# Altium schematic sheet AFE.SchDoc (part 1 of 3)
size 863 x 558 mm; Date: 28.05.2024; ApprovedBy: Arda B.; CheckedBy: Arda B.; DrawnBy: Arda Bozkurt; Revision: 001; SheetNumber: 3; SheetTotal: 5; Department: HDD; Size: A3; Time: 28.05.2024
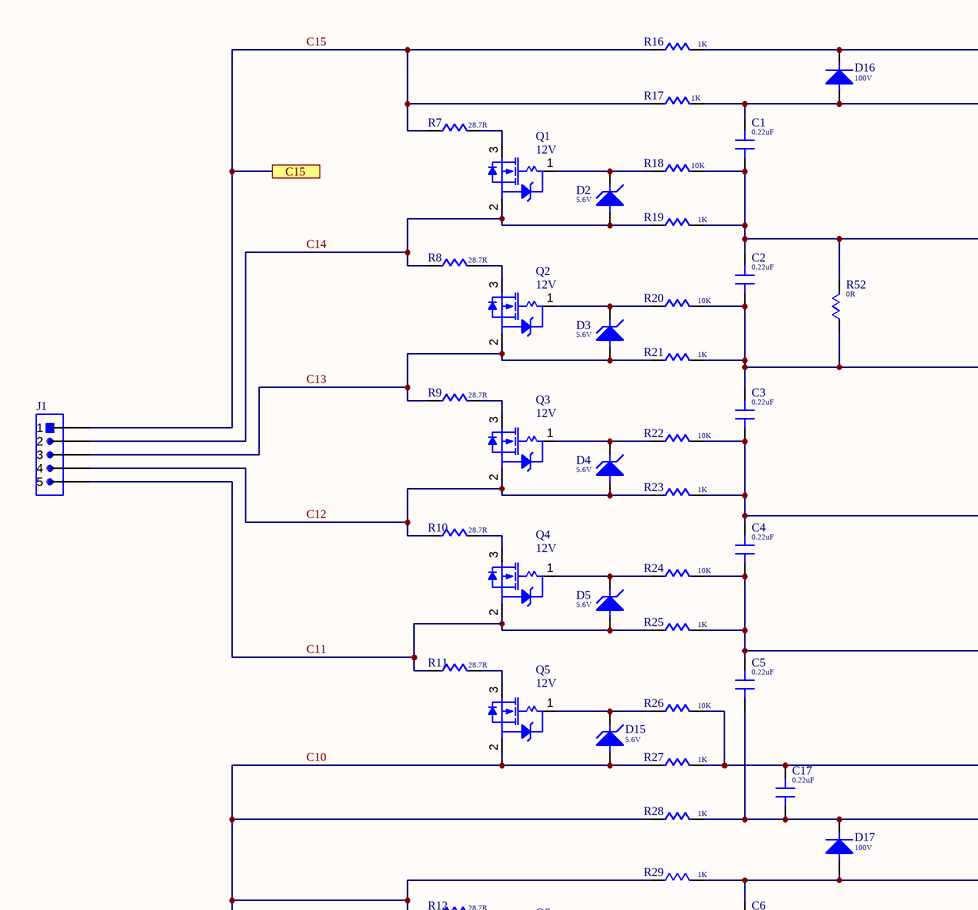
[diagram p0: AFE.SchDoc, top left]
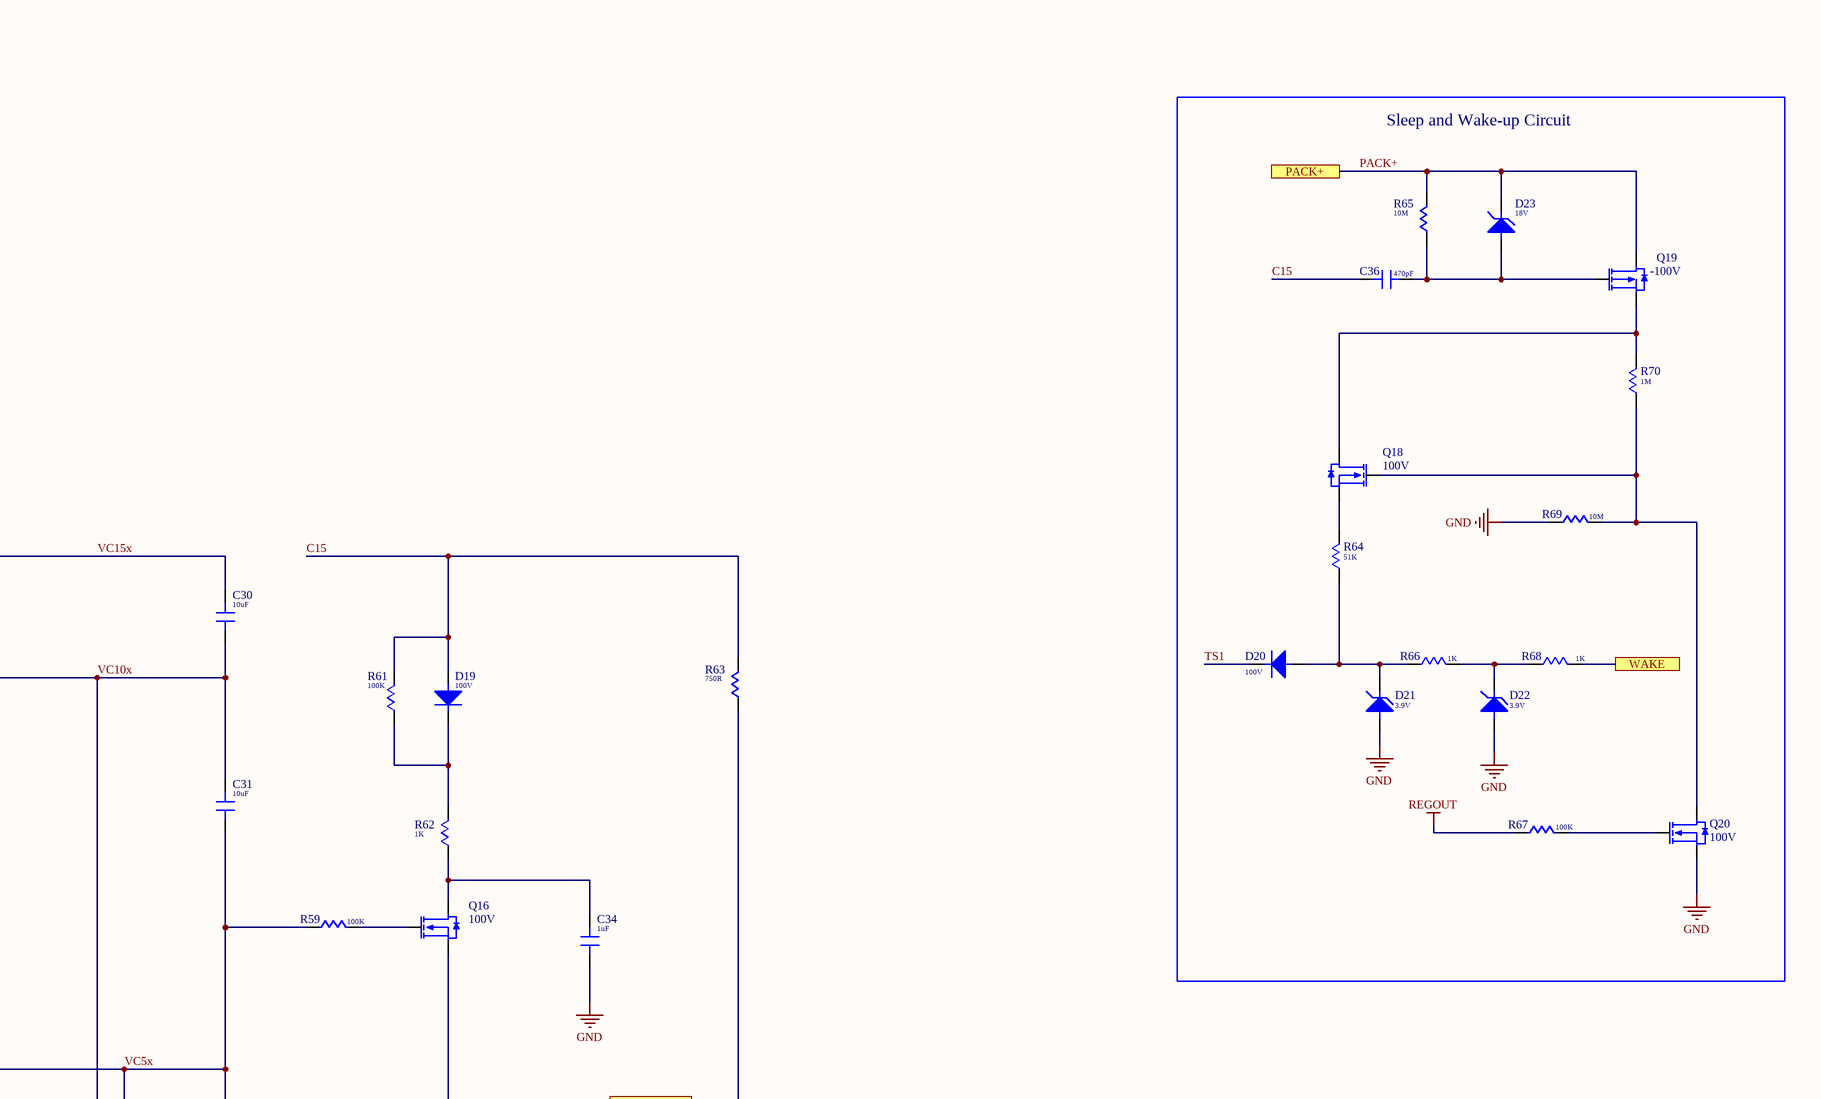
[diagram p1: AFE.SchDoc, top right]
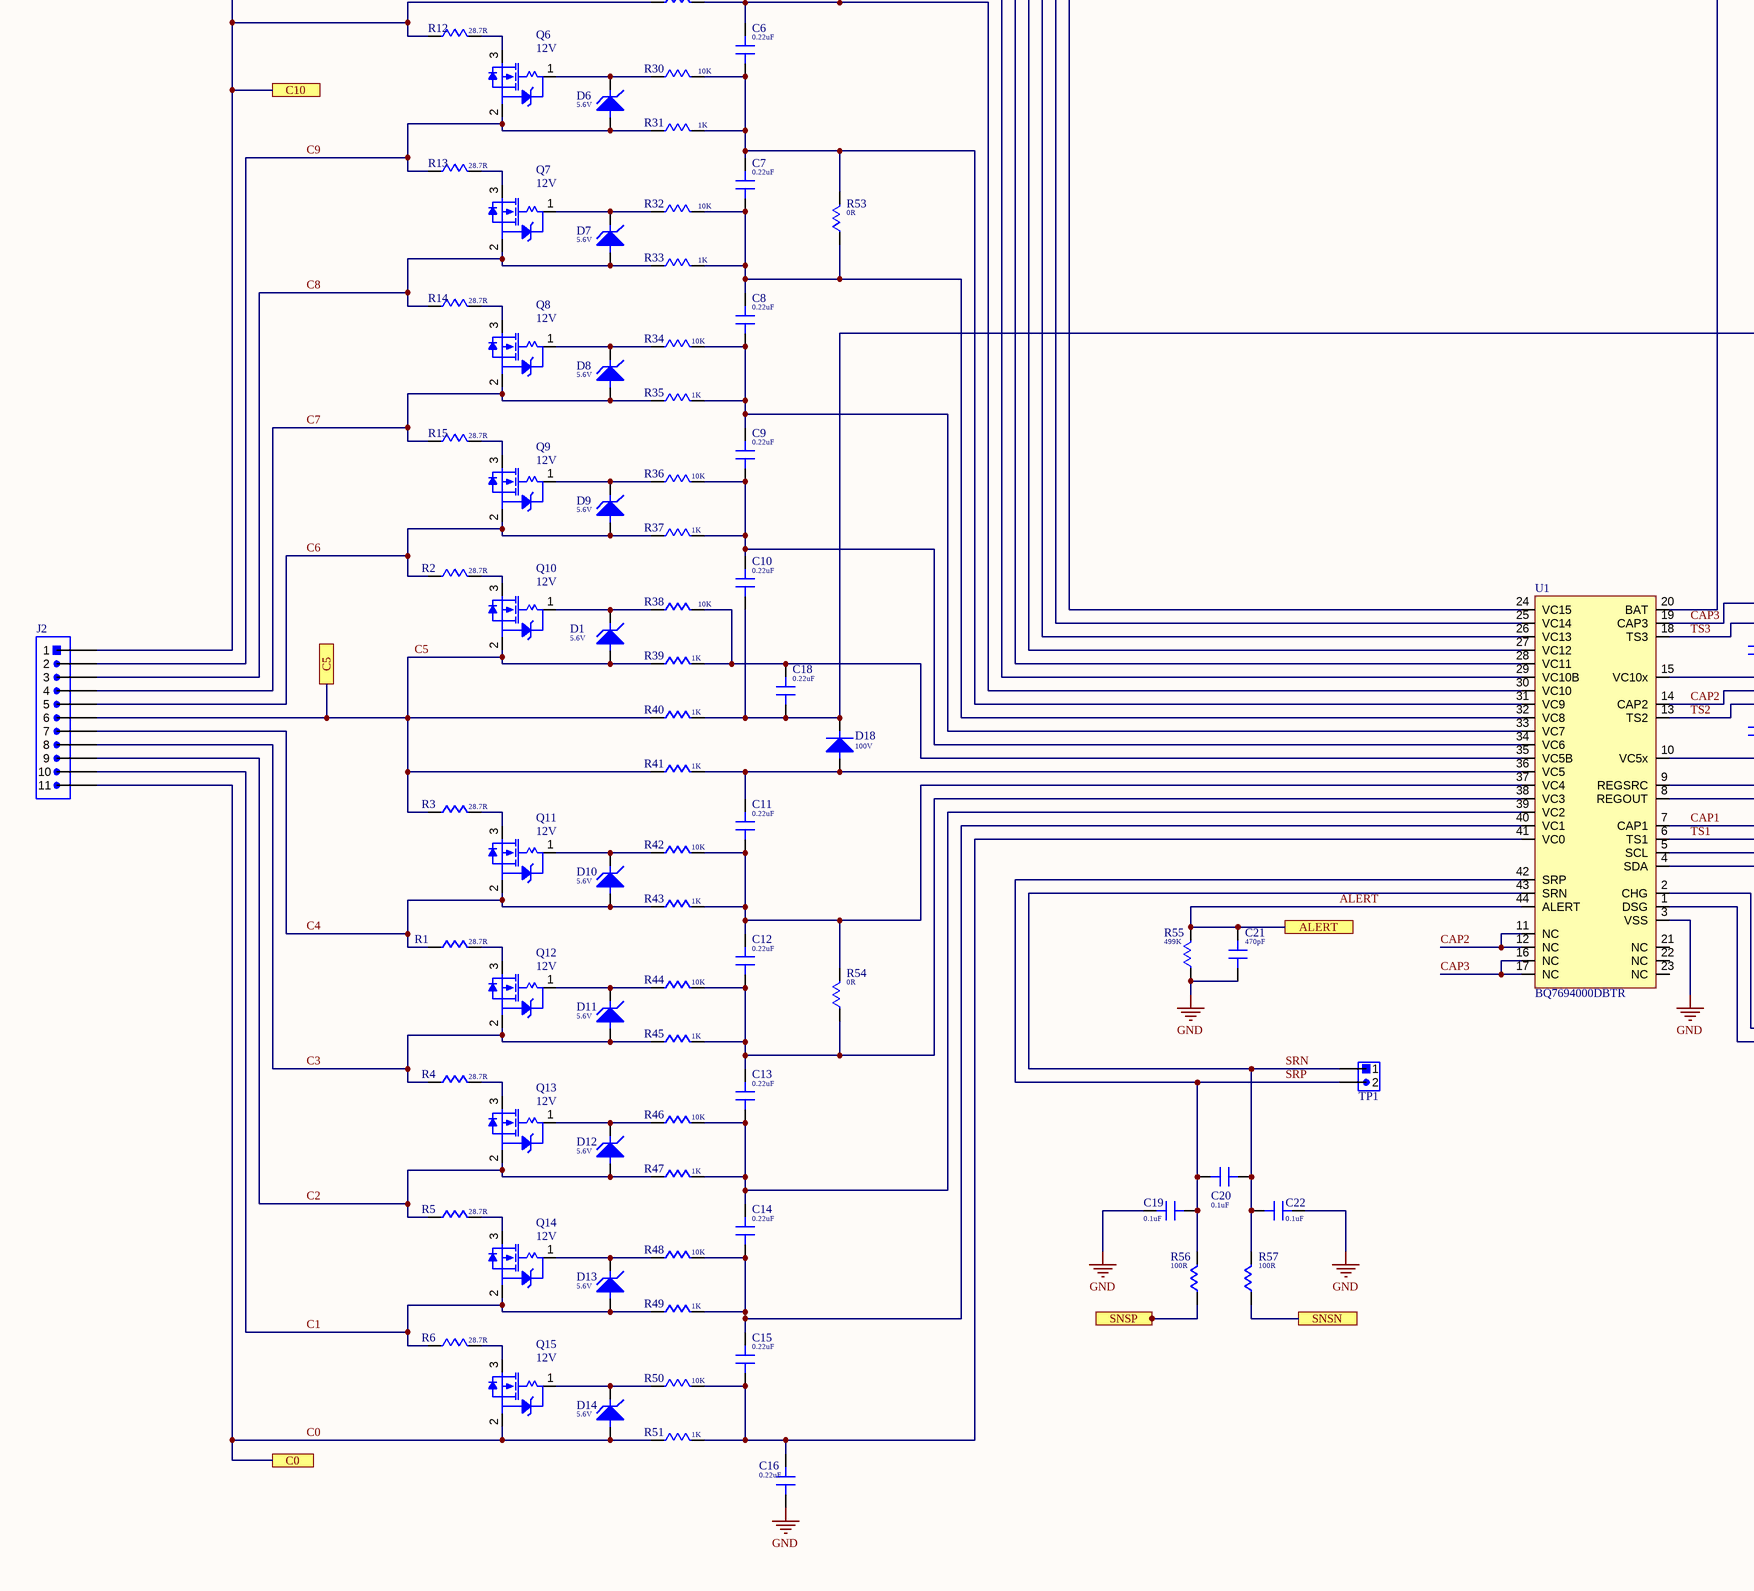
[diagram p2: AFE.SchDoc, bottom left]
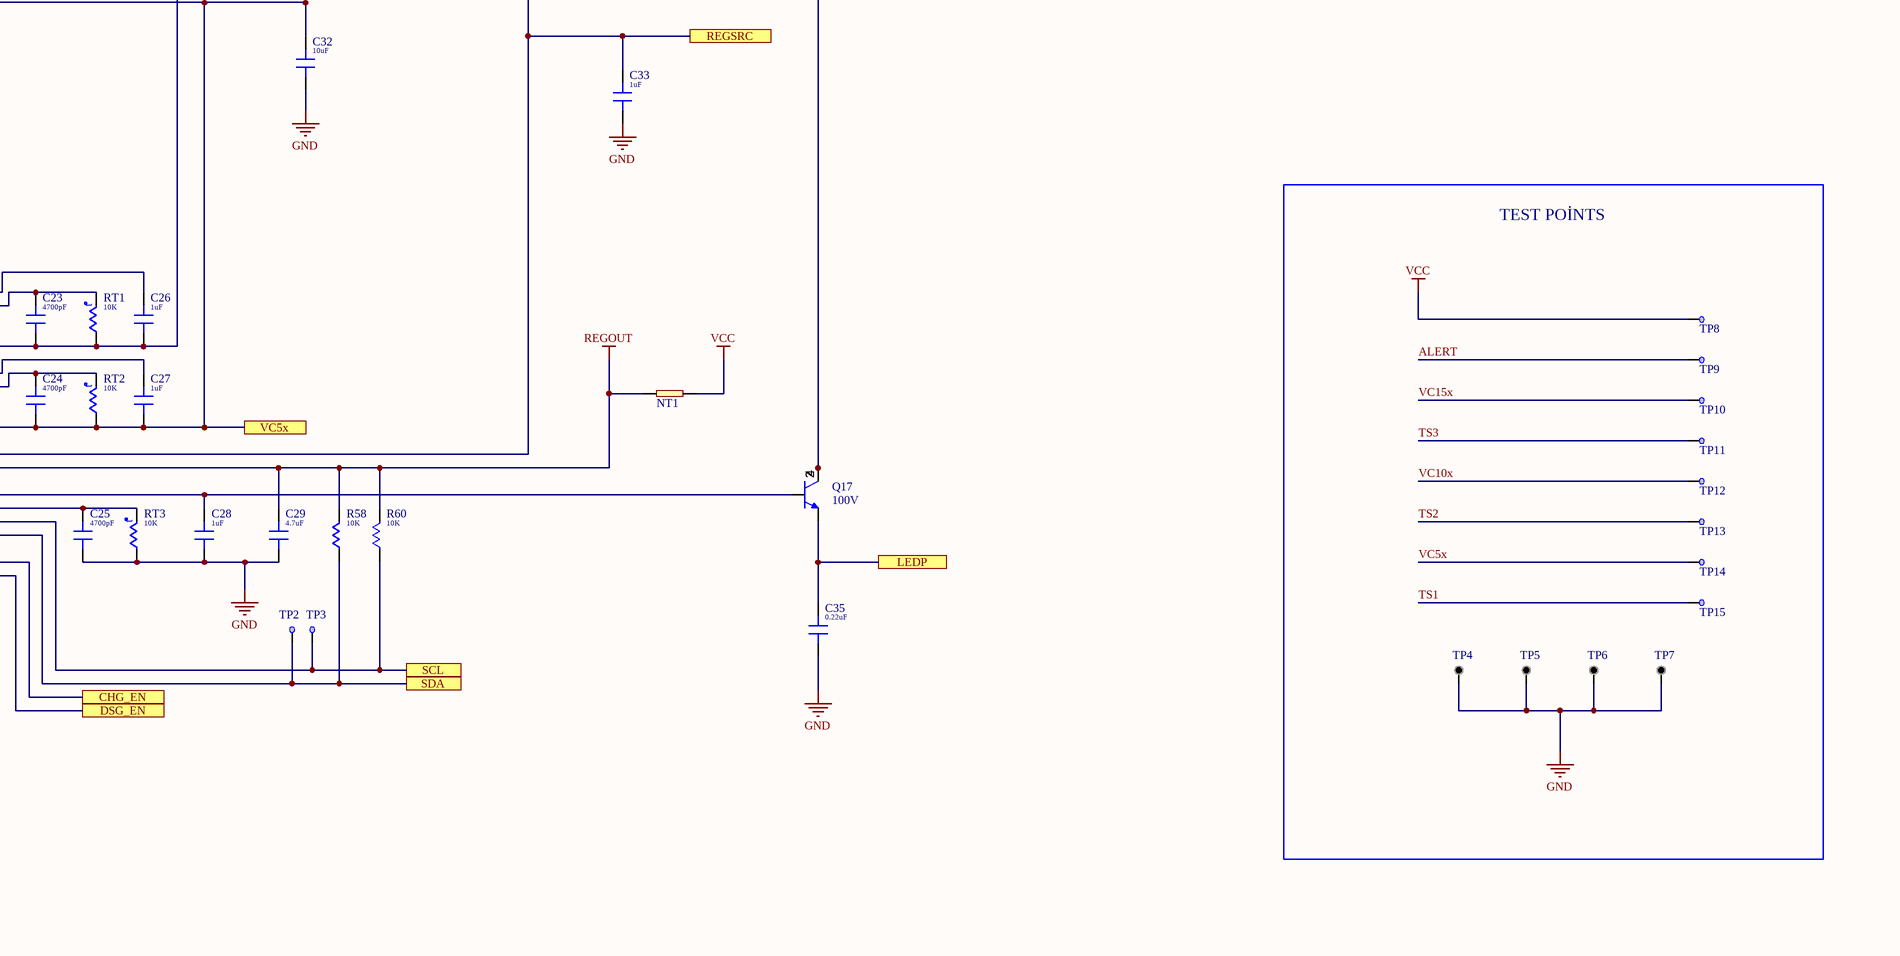
[diagram p3: AFE.SchDoc, bottom right]

## Parts
C1  value 0.22uF  [C_0603]  (hidden comment: 885012206048)
C2  value 0.22uF  [C_0603]  (hidden comment: 885012206048)
C3  value 0.22uF  [C_0603]  (hidden comment: 885012206048)
C4  value 0.22uF  [C_0603]  (hidden comment: 885012206048)
C5  value 0.22uF  [C_0603]  (hidden comment: 885012206048)
C6  value 0.22uF  [C_0603]  (hidden comment: 885012206048)
C7  value 0.22uF  [C_0603]  (hidden comment: 885012206048)
C8  value 0.22uF  [C_0603]  (hidden comment: 885012206048)
C9  value 0.22uF  [C_0603]  (hidden comment: 885012206048)
C10  value 0.22uF  [C_0603]  (hidden comment: 885012206048)
C11  value 0.22uF  [C_0603]  (hidden comment: 885012206048)
C12  value 0.22uF  [C_0603]  (hidden comment: 885012206048)
C13  value 0.22uF  [C_0603]  (hidden comment: 885012206048)
C14  value 0.22uF  [C_0603]  (hidden comment: 885012206048)
C15  value 0.22uF  [C_0603]  (hidden comment: 885012206048)
C16  value 0.22uF  [C_0603]  (hidden comment: 885012206048)
C17  value 0.22uF  [C_0603]  (hidden comment: 885012206048)
C18  value 0.22uF  [C_0603]  (hidden comment: 885012206048)
C19  value 0.1uF  [C_0603]  (hidden comment: C1608X7R1H104K080AA)
C20  value 0.1uF  [C_0603]  (hidden comment: C1608X7R1H104K080AA)
C21  value 470pF  [C_0603]  (hidden comment: 885012206081)
C22  value 0.1uF  [C_0603]  (hidden comment: C1608X7R1H104K080AA)
C23  value 4700pF  [C_0603]  (hidden comment: 885012206087)
C24  value 4700pF  [C_0603]  (hidden comment: 885012206087)
C25  value 4700pF  [C_0603]  (hidden comment: 885012206087)
C26  value 1uF  [C_0603]  (hidden comment: 885012206052)
C27  value 1uF  [C_0603]  (hidden comment: 885012206052)
C28  value 1uF  [C_0603]  (hidden comment: 885012206052)
C29  value 4.7uF  [C_0805]  (hidden comment: 885012207025)
C30  value 10uF  [C_1210]  (hidden comment: GRM32ER7YA106KA12L)
C31  value 10uF  [C_1210]  (hidden comment: GRM32ER7YA106KA12L)
C32  value 10uF  [C_1210]  (hidden comment: GRM32ER7YA106KA12L)
C33  value 1uF  [C_0805]  (hidden comment: GRM21BR71H105KA12L)
C34  value 1uF  [C_0805]  (hidden comment: GRM21BR71H105KA12L)
C35  value 0.22uF  [C_0603]  (hidden comment: 885012206048)
C36  value 470pF  [C_0603]  (hidden comment: 885012206081)
D1  value 5.6V  [D_SOD323]  (hidden comment: MMSZ5232BS-7-F)
D2  value 5.6V  [D_SOD323]  (hidden comment: MMSZ5232BS-7-F)
D3  value 5.6V  [D_SOD323]  (hidden comment: MMSZ5232BS-7-F)
D4  value 5.6V  [D_SOD323]  (hidden comment: MMSZ5232BS-7-F)
D5  value 5.6V  [D_SOD323]  (hidden comment: MMSZ5232BS-7-F)
D6  value 5.6V  [D_SOD323]  (hidden comment: MMSZ5232BS-7-F)
D7  value 5.6V  [D_SOD323]  (hidden comment: MMSZ5232BS-7-F)
D8  value 5.6V  [D_SOD323]  (hidden comment: MMSZ5232BS-7-F)
D9  value 5.6V  [D_SOD323]  (hidden comment: MMSZ5232BS-7-F)
D10  value 5.6V  [D_SOD323]  (hidden comment: MMSZ5232BS-7-F)
D11  value 5.6V  [D_SOD323]  (hidden comment: MMSZ5232BS-7-F)
D12  value 5.6V  [D_SOD323]  (hidden comment: MMSZ5232BS-7-F)
D13  value 5.6V  [D_SOD323]  (hidden comment: MMSZ5232BS-7-F)
D14  value 5.6V  [D_SOD323]  (hidden comment: MMSZ5232BS-7-F)
D15  value 5.6V  [D_SOD323]  (hidden comment: MMSZ5232BS-7-F)
D16  value 100V  [D_SOD123]  (hidden comment: 1N4148W-7-F)
D17  value 100V  [D_SOD123]  (hidden comment: 1N4148W-7-F)
D18  value 100V  [D_SOD123]  (hidden comment: 1N4148W-7-F)
D19  value 100V  [D_SOD123]  (hidden comment: 1N4148W-7-F)
D20  value 100V  [D_SOD123]  (hidden comment: 1N4148W-7-F)
D21  value 3.9V  [D_SOD323]  (hidden comment: MMSZ5228BS-7-F)
D22  value 3.9V  [D_SOD323]  (hidden comment: MMSZ5228BS-7-F)
D23  value 18V  [D_SOD323]  (hidden comment: MMSZ5248BS-7-F)
J1  0395021005  [TB_5]  (value not drawn)
J2  0395021011  [TB_11]  (value not drawn)
NT1  Net Tie  [NET_TİE_1]  (value not drawn)  (net tie)
Q1  Voltage: 12V  [Q_3PICOSTAR]  (hidden comment: CSD13381F4)
Q2  Voltage: 12V  [Q_3PICOSTAR]  (hidden comment: CSD13381F4)
Q3  Voltage: 12V  [Q_3PICOSTAR]  (hidden comment: CSD13381F4)
Q4  Voltage: 12V  [Q_3PICOSTAR]  (hidden comment: CSD13381F4)
Q5  Voltage: 12V  [Q_3PICOSTAR]  (hidden comment: CSD13381F4)
Q6  Voltage: 12V  [Q_3PICOSTAR]  (hidden comment: CSD13381F4)
Q7  Voltage: 12V  [Q_3PICOSTAR]  (hidden comment: CSD13381F4)
Q8  Voltage: 12V  [Q_3PICOSTAR]  (hidden comment: CSD13381F4)
Q9  Voltage: 12V  [Q_3PICOSTAR]  (hidden comment: CSD13381F4)
Q10  Voltage: 12V  [Q_3PICOSTAR]  (hidden comment: CSD13381F4)
Q11  Voltage: 12V  [Q_3PICOSTAR]  (hidden comment: CSD13381F4)
Q12  Voltage: 12V  [Q_3PICOSTAR]  (hidden comment: CSD13381F4)
Q13  Voltage: 12V  [Q_3PICOSTAR]  (hidden comment: CSD13381F4)
Q14  Voltage: 12V  [Q_3PICOSTAR]  (hidden comment: CSD13381F4)
Q15  Voltage: 12V  [Q_3PICOSTAR]  (hidden comment: CSD13381F4)
Q16  Voltage: 100V  [Q_SOT23-3]  (hidden comment: BST82,215)
Q17  Voltage: 100V  [Q_SOT-89-3]  (hidden comment: ZXTN19100CZTA)
Q18  Voltage: 100V  [Q_SOT23-3]  (hidden comment: BSS123)
Q19  Voltage Rating (DC): -100V  [Q_SOT23-3]  (hidden comment: ZXMP10A13FTA)
Q20  Voltage: 100V  [Q_SOT23-3]  (hidden comment: BSS123)
R1  value 28.7R  [R_2010]  (hidden comment: CRCW201028R7FKEF)
R2  value 28.7R  [R_2010]  (hidden comment: CRCW201028R7FKEF)
R3  value 28.7R  [R_2010]  (hidden comment: CRCW201028R7FKEF)
R4  value 28.7R  [R_2010]  (hidden comment: CRCW201028R7FKEF)
R5  value 28.7R  [R_2010]  (hidden comment: CRCW201028R7FKEF)
R6  value 28.7R  [R_2010]  (hidden comment: CRCW201028R7FKEF)
R7  value 28.7R  [R_2010]  (hidden comment: CRCW201028R7FKEF)
R8  value 28.7R  [R_2010]  (hidden comment: CRCW201028R7FKEF)
R9  value 28.7R  [R_2010]  (hidden comment: CRCW201028R7FKEF)
R10  value 28.7R  [R_2010]  (hidden comment: CRCW201028R7FKEF)
R11  value 28.7R  [R_2010]  (hidden comment: CRCW201028R7FKEF)
R12  value 28.7R  [R_2010]  (hidden comment: CRCW201028R7FKEF)
R13  value 28.7R  [R_2010]  (hidden comment: CRCW201028R7FKEF)
R14  value 28.7R  [R_2010]  (hidden comment: CRCW201028R7FKEF)
R15  value 28.7R  [R_2010]  (hidden comment: CRCW201028R7FKEF)
R16  value 1K  [R_0603]  (hidden comment: CRCW06031K00JNEA)
R17  value 1K  [R_0603]  (hidden comment: CRCW06031K00JNEA)
R18  value 10K  [R_0603]  (hidden comment: CRCW060310K0JNEA)
R19  value 1K  [R_0603]  (hidden comment: CRCW06031K00JNEA)
R20  value 10K  [R_0603]  (hidden comment: CRCW060310K0JNEA)
R21  value 1K  [R_0603]  (hidden comment: CRCW06031K00JNEA)
R22  value 10K  [R_0603]  (hidden comment: CRCW060310K0JNEA)
R23  value 1K  [R_0603]  (hidden comment: CRCW06031K00JNEA)
R24  value 10K  [R_0603]  (hidden comment: CRCW060310K0JNEA)
R25  value 1K  [R_0603]  (hidden comment: CRCW06031K00JNEA)
R26  value 10K  [R_0603]  (hidden comment: CRCW060310K0JNEA)
R27  value 1K  [R_0603]  (hidden comment: CRCW06031K00JNEA)
R28  value 1K  [R_0603]  (hidden comment: CRCW06031K00JNEA)
R29  value 1K  [R_0603]  (hidden comment: CRCW06031K00JNEA)
R30  value 10K  [R_0603]  (hidden comment: CRCW060310K0JNEA)
R31  value 1K  [R_0603]  (hidden comment: CRCW06031K00JNEA)
R32  value 10K  [R_0603]  (hidden comment: CRCW060310K0JNEA)
R33  value 1K  [R_0603]  (hidden comment: CRCW06031K00JNEA)
R34  value 10K  [R_0603]  (hidden comment: CRCW060310K0JNEA)
R35  value 1K  [R_0603]  (hidden comment: CRCW06031K00JNEA)
R36  value 10K  [R_0603]  (hidden comment: CRCW060310K0JNEA)
R37  value 1K  [R_0603]  (hidden comment: CRCW06031K00JNEA)
R38  value 10K  [R_0603]  (hidden comment: CRCW060310K0JNEA)
R39  value 1K  [R_0603]  (hidden comment: CRCW06031K00JNEA)
R40  value 1K  [R_0603]  (hidden comment: CRCW06031K00JNEA)
R41  value 1K  [R_0603]  (hidden comment: CRCW06031K00JNEA)
R42  value 10K  [R_0603]  (hidden comment: CRCW060310K0JNEA)
R43  value 1K  [R_0603]  (hidden comment: CRCW06031K00JNEA)
R44  value 10K  [R_0603]  (hidden comment: CRCW060310K0JNEA)
R45  value 1K  [R_0603]  (hidden comment: CRCW06031K00JNEA)
R46  value 10K  [R_0603]  (hidden comment: CRCW060310K0JNEA)
R47  value 1K  [R_0603]  (hidden comment: CRCW06031K00JNEA)
R48  value 10K  [R_0603]  (hidden comment: CRCW060310K0JNEA)
R49  value 1K  [R_0603]  (hidden comment: CRCW06031K00JNEA)
R50  value 10K  [R_0603]  (hidden comment: CRCW060310K0JNEA)
R51  value 1K  [R_0603]  (hidden comment: CRCW06031K00JNEA)
R52  value 0R  [R_0603]  (hidden comment: CRCW06030000Z0EA)
R53  value 0R  [R_0603]  (hidden comment: CRCW06030000Z0EA)
R54  value 0R  [R_0603]  (hidden comment: CRCW06030000Z0EA)
R55  value 499K  [R_0603]  (hidden comment: CRCW0603499KFKEA)
R56  value 100R  [R_0805]  (hidden comment: CRCW0805100RFKEA)
R57  value 100R  [R_0805]  (hidden comment: CRCW0805100RFKEA)
R58  value 10K  [R_0603]  (hidden comment: CRCW060310K0JNEA)
R59  value 100K  [R_0805]  (hidden comment: CRCW0805100KFKEA)
R60  value 10K  [R_0603]  (hidden comment: CRCW060310K0JNEA)
R61  value 100K  [R_0805]  (hidden comment: CRCW0805100KFKEA)
R62  value 1K  [R_2010]  (hidden comment: CRCW20101K00JNEF)
R63  value 750R  [R_2010]  (hidden comment: CRCW2010750RJNEF)
R64  value 51K  [R_0603]  (hidden comment: CRCW060351K0JNEA)
R65  value 10M  [R_0603]  (hidden comment: CRCW060310M0FKEA)
R66  value 1K  [R_0603]  (hidden comment: CRCW06031K00JNEA)
R67  value 100K  [R_0805]  (hidden comment: CRCW0805100KFKEA)
R68  value 1K  [R_0603]  (hidden comment: CRCW06031K00JNEA)
R69  value 10M  [R_0603]  (hidden comment: CRCW060310M0FKEA)
R70  value 1M  [R_0603]  (hidden comment: CRCW06031M00JNEA)
RT1  value 10K  [NTC]  (hidden comment: 103AT-2)
RT2  value 10K  [NTC]  (hidden comment: 103AT-2)
RT3  value 10K  [NTC]  (hidden comment: 103AT-2)
TP1  PEC02SAAN  [TP_2POS]  (value not drawn)
TP2  5011  [TP_VİA]  (value not drawn)
TP3  5011  [TP_VİA]  (value not drawn)
TP4  TEST POİNT  [TP_GND]  (value not drawn)
TP5  TEST POİNT  [TP_GND]  (value not drawn)
TP6  TEST POİNT  [TP_GND]  (value not drawn)
TP7  TEST POİNT  [TP_GND]  (value not drawn)
TP8  5011  [TP_VİA]  (value not drawn)
TP9  5011  [TP_VİA]  (value not drawn)
TP10  5011  [TP_VİA]  (value not drawn)
TP11  5011  [TP_VİA]  (value not drawn)
TP12  5011  [TP_VİA]  (value not drawn)
TP13  5011  [TP_VİA]  (value not drawn)
TP14  5011  [TP_VİA]  (value not drawn)
TP15  5011  [TP_VİA]  (value not drawn)
U1  BQ7694000DBTR  [44TSSOP]

## Blocks framed on the sheet
Sleep and Wake-up Circuit: C36 D20-D23 Q18-Q20 R64-R70
TEST POİNTS: TP4-TP15

## Ports
ALERT (see GUAGE[3B]), C0 (see FET[3A]), C5, C10, C15 (see FET[3B], GUAGE[2A]), CHG_EN (see FET[3C]), DSG_EN (see FET[3D]), LEDP (see GUAGE[5A]), PACK+ (see FET[6A]), REGSRC, SCL (see GUAGE[3B]), SDA (see GUAGE[3B]), SNSN (see FET[4A]), SNSP (see FET[4A]), VC5x, WAKE (see GUAGE[1B], GUAGE[2D])

## Nets
GND: C16.1 C19.1 C21.1 C22.2 C25.1 C28.1 C29.1 C32.1 C33.1 C34.1 C35.1 D21.2 D22.2 Q20.2(S) R55.1 R69.1 RT3.1 TP4.1 TP5.1 TP6.1 TP7.1 U1.3(VSS)
REGOUT: C29.2 NT1.1 R58.2 R60.2 R67.1 U1.8(REGOUT)
VCC: NT1.2 TP8.1
ALERT: C21.2 R55.2 TP9.1 U1.44(ALERT) ; port ALERT
C0: D14.2 J2.11 Q15.2(S) R51.1 ; port C0
C1: D13.2 J2.10 Q14.2(S) R6.1 R49.1
C2: D12.2 J2.9 Q13.2(S) R5.1 R47.1
C3: D11.2 J2.8 Q12.2(S) R4.1 R45.1
C4: D10.2 J2.7 Q11.2(S) R1.1 R43.1
C5: D1.2 J2.6 Q10.2(S) R3.1 R39.1 R40.1 R41.1 ; port C5
C6: D9.2 J2.5 Q9.2(S) R2.1 R37.1
C7: D8.2 J2.4 Q8.2(S) R15.1 R35.1
C8: D7.2 J2.3 Q7.2(S) R14.1 R33.1
C9: D6.2 J2.2 Q6.2(S) R13.1 R31.1
C10: D15.2 J2.1 Q5.2(S) R12.1 R27.1 R28.1 R29.1 ; port C10
C11: D5.2 J1.5 Q4.2(S) R11.1 R25.1
C12: D4.2 J1.4 Q3.2(S) R10.1 R23.1
C13: D3.2 J1.3 Q2.2(S) R9.1 R21.1
C14: D2.2 J1.2 Q1.2(S) R8.1 R19.1
C15: C36.1 D19.2 J1.1 R7.1 R16.1 R17.1 R61.2 R63.2 ; port C15
CAP1: C28.2 Q17.1(B) U1.7(CAP1)
CAP2: C27.1 U1.11(NC) U1.12(NC) U1.14(CAP2)
CAP3: C26.1 U1.16(NC) U1.17(NC) U1.19(CAP3)
CHG_EN: U1.2(CHG) ; port CHG_EN
DSG_EN: U1.1(DSG) ; port DSG_EN
LEDP: C35.2 Q17.3(E) ; port LEDP
PACK+: D23.1 Q19.2(S) R65.2 ; port PACK+
REGSRC: C33.2 Q16.2(S) U1.9(REGSRC) ; port REGSRC
SCL: R60.1 TP3.1 U1.5(SCL) ; port SCL
SDA: R58.1 TP2.1 U1.4(SDA) ; port SDA
SNSN: R57.1 ; port SNSN
SNSP: R56.1 ; port SNSP
SRN: C20.2 C22.1 R57.2 TP1.1 U1.43(SRN)
SRP: C19.2 C20.1 R56.2 TP1.2 U1.42(SRP)
TS1: C25.2 D20.1 RT3.2 TP15.1 U1.6(TS1)
TS2: C24.1 RT2.2 TP13.1 U1.13(TS2)
TS3: C23.1 RT1.2 TP11.1 U1.18(TS3)
VC5x: C10.1 C18.1 C24.2 C27.2 C31.1 C32.2 D18.1 R40.2 R59.1 RT2.1 TP14.1 U1.10(VC5x) ; port VC5x
VC10x: C5.1 C17.1 C23.2 C26.2 C30.1 C31.2 D17.1 R28.2 RT1.1 TP12.1 U1.15(VC10x)
VC15x: C30.2 D16.1 R16.2 TP10.1 U1.20(BAT)
WAKE: R68.2 ; port WAKE
NetC1_1: C1.1 C2.2 R18.2 R19.2 R52.2 U1.25(VC14)
NetC1_2: C1.2 D16.2 R17.2 U1.24(VC15)
NetC2_1: C2.1 C3.2 R20.2 R21.2 R52.1 U1.26(VC13)
NetC3_1: C3.1 C4.2 R22.2 R23.2 U1.27(VC12)
NetC4_1: C4.1 C5.2 R24.2 R25.2 U1.28(VC11)
NetC6_1: C6.1 C7.2 R30.2 R31.2 R53.2 U1.31(VC9)
NetC6_2: C6.2 D17.2 R29.2 U1.30(VC10)
NetC7_1: C7.1 C8.2 R32.2 R33.2 R53.1 U1.32(VC8)
NetC8_1: C8.1 C9.2 R34.2 R35.2 U1.33(VC7)
NetC9_1: C9.1 C10.2 R36.2 R37.2 U1.34(VC6)
NetC11_1: C11.1 C12.2 R42.2 R43.2 R54.2 U1.37(VC4)
NetC11_2: C11.2 D18.2 R41.2 U1.36(VC5)
NetC12_1: C12.1 C13.2 R44.2 R45.2 R54.1 U1.38(VC3)
NetC13_1: C13.1 C14.2 R46.2 R47.2 U1.39(VC2)
NetC14_1: C14.1 C15.2 R48.2 R49.2 U1.40(VC1)
NetC15_1: C15.1 C16.2 R50.2 R51.2 U1.41(VC0)
NetC17_2: C17.2 R26.2 R27.2 U1.29(VC10B)
NetC18_2: C18.2 R38.2 R39.2 U1.35(VC5B)
NetC34_2: C34.2 Q16.3(D) R62.1
NetC36_2: C36.2 D23.2 Q19.1(G) R65.1
NetD1_1: D1.1 Q10.1(G) R38.1
NetD2_1: D2.1 Q1.1(G) R18.1
NetD3_1: D3.1 Q2.1(G) R20.1
NetD4_1: D4.1 Q3.1(G) R22.1
NetD5_1: D5.1 Q4.1(G) R24.1
NetD6_1: D6.1 Q6.1(G) R30.1
NetD7_1: D7.1 Q7.1(G) R32.1
NetD8_1: D8.1 Q8.1(G) R34.1
NetD9_1: D9.1 Q9.1(G) R36.1
NetD10_1: D10.1 Q11.1(G) R42.1
NetD11_1: D11.1 Q12.1(G) R44.1
NetD12_1: D12.1 Q13.1(G) R46.1
NetD13_1: D13.1 Q14.1(G) R48.1
NetD14_1: D14.1 Q15.1(G) R50.1
NetD15_1: D15.1 Q5.1(G) R26.1
NetD19_1: D19.1 R61.1 R62.2
NetD20_2: D20.2 D21.1 R64.1 R66.1
NetD22_1: D22.1 R66.2 R68.1
NetQ1_3: Q1.3(D) R7.2
NetQ2_3: Q2.3(D) R8.2
NetQ3_3: Q3.3(D) R9.2
NetQ4_3: Q4.3(D) R10.2
NetQ5_3: Q5.3(D) R11.2
NetQ6_3: Q6.3(D) R12.2
NetQ7_3: Q7.3(D) R13.2
NetQ8_3: Q8.3(D) R14.2
NetQ9_3: Q9.3(D) R15.2
NetQ10_3: Q10.3(D) R2.2
NetQ11_3: Q11.3(D) R3.2
NetQ12_3: Q12.3(D) R1.2
NetQ13_3: Q13.3(D) R4.2
NetQ14_3: Q14.3(D) R5.2
NetQ15_3: Q15.3(D) R6.2
NetQ16_1: Q16.1(G) R59.2
NetQ17_2: Q17.2(C) Q17.4(C) R63.1
NetQ18_1: Q18.1(G) Q20.3(D) R69.2 R70.1
NetQ18_2: Q18.2(S) R64.2
NetQ18_3: Q18.3(D) Q19.3(D) R70.2
NetQ20_1: Q20.1(G) R67.2

Not connected (* = marked no-connect by the designer): U1 21(NC) 22(NC) 23(NC)

## Notes on the sheet
- REVISION
- DESCRIPTION
- DATE
- APPROVED
- DOSYA ADI/FİLE NAME
- TAINIM/DESCRIPTION
- HAZIRLAYAN/PREPARED BY
- YAYIN TARİHİ/REL. DATE
- KONTROL EDEN/ CHECKED BY
- DEĞ TARİHİ/CHANCE DATE
- ONAYLAYAN/APPROVED BY
- REVİZYON/REVISION
- Arda Bozkurt
- BÖLÜM/DEPARTMENT
- BOYUT/SİZE
- SAYFA/SHEET
- of
- (in symbol NTC_TERMISTOR_10K_%1) t